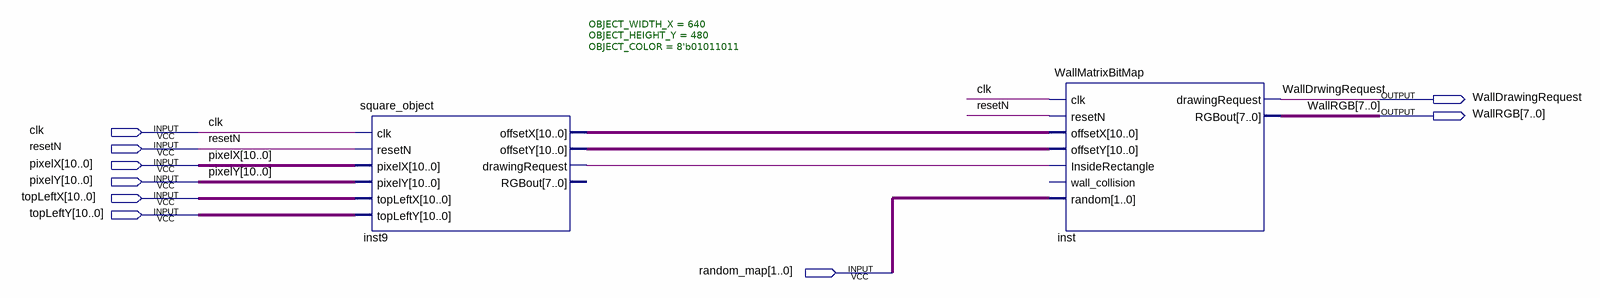
[diagram p0: schematic sheet]
// Quartus schematic WALL_DISPLAY.bdf as structural Verilog: 2 symbols, 9 pins
module WALL_DISPLAY (
  input  clk,
  input  resetN,
  input  [10:0] pixelX,
  input  [10:0] pixelY,
  input  [10:0] topLeftX,
  input  [10:0] topLeftY,
  input  [1:0] random_map,
  output WallDrawingRequest,
  output [7:0] WallRGB
);

  wire inst9_drawingrequest;
  wire [10:0] inst9_offsetx, inst9_offsety;

  square_object #(.OBJECT_WIDTH_X(640), .OBJECT_HEIGHT_Y(480), .OBJECT_COLOR(8'b01011011)) inst9 (
    .clk(clk), .resetN(resetN), .pixelX(pixelX), .pixelY(pixelY), .topLeftX(topLeftX), .topLeftY(topLeftY),
    .offsetX(inst9_offsetx), .offsetY(inst9_offsety), .drawingRequest(inst9_drawingrequest));  // open: RGBout
  WallMatrixBitMap inst (
    .clk(clk), .resetN(resetN), .offsetX(inst9_offsetx), .offsetY(inst9_offsety),
    .InsideRectangle(inst9_drawingrequest), .random(random_map), .drawingRequest(WallDrawingRequest),
    .RGBout(WallRGB));  // open: wall_collision

  // Other names for the same wires on the sheet: WallDrwingRequest = WallDrawingRequest
endmodule
